# Altium schematic sheet ISO_SPI.SchDoc
size A
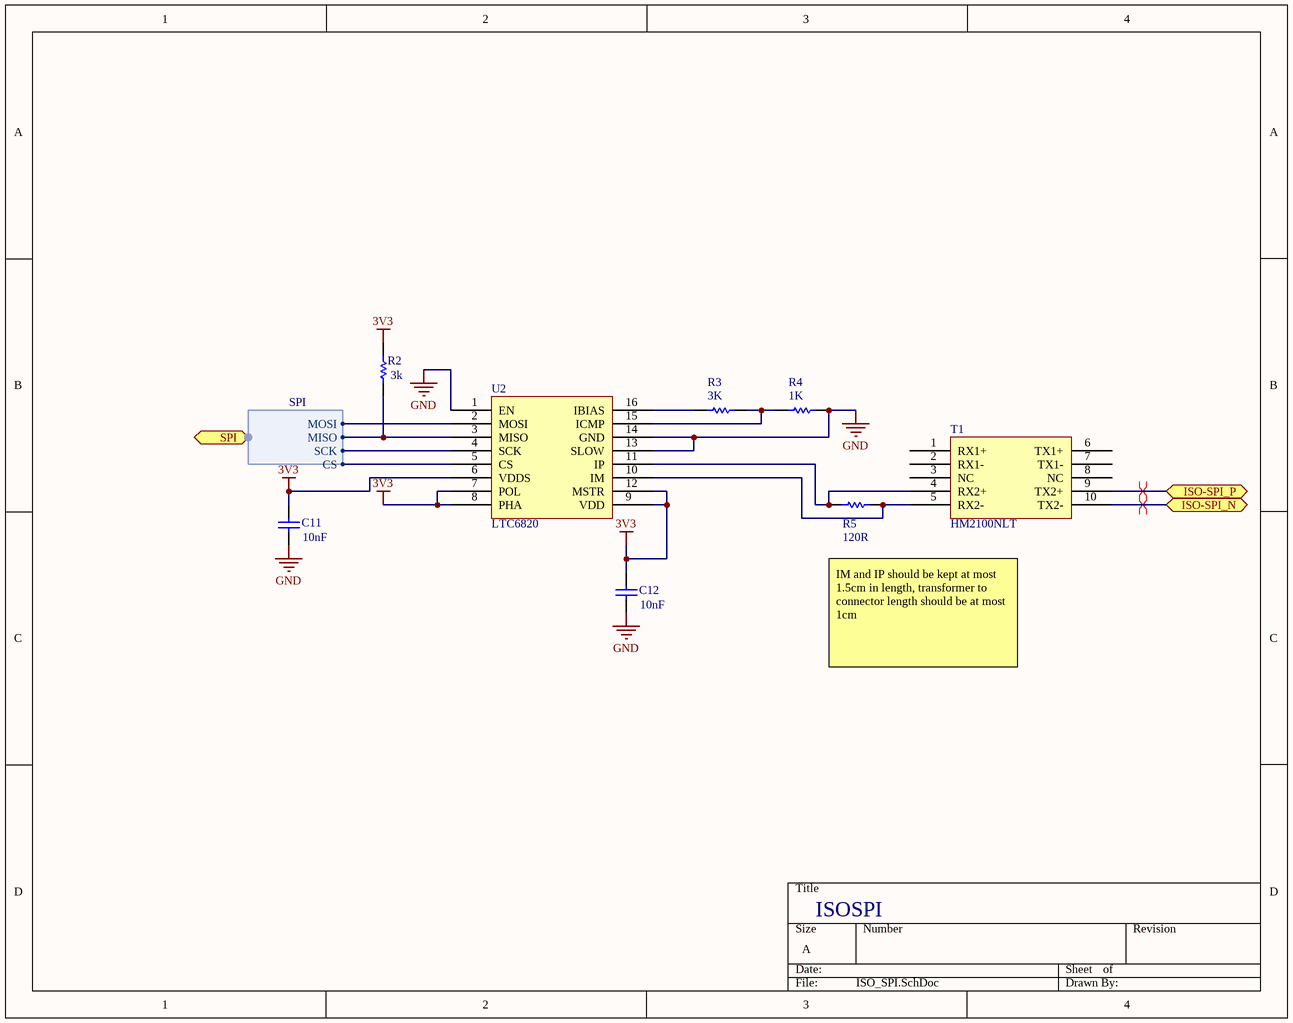
[diagram p0: ISO_SPI.SchDoc]

## Parts
C11  value 10nF  [C0805]  (hidden comment: 10V)
C12  value 10nF  [C0805]  (hidden comment: 10V)
R2  value 3k  [J1-0603]  (hidden comment: 1%)
R3  value 3K  [J1-0603]  (hidden comment: 1%)
R4  value 1K  [J1-0603]  (hidden comment: 1%)
R5  value 120R  [J1-0603]  (hidden comment: 1%)
T1  HM2100NLT  [HM2100NLT]
U2  LTC6820  [LTC6820]

## Ports
ISO-SPI_N (bidir), ISO-SPI_P (bidir), SPI (bidir, harness SPI)

## Harnesses
SPI: MOSI, MISO, SCK, CS

## Nets
3V3: C11.1 C12.1 R2.2 U2.6(VDDS) U2.7(POL) U2.8(PHA) U2.9(VDD) U2.12(MSTR)
GND: C11.2 C12.2 R4.2 U2.1(EN) U2.13(SLOW) U2.14(GND)
ISO-SPI_N: T1.10(TX2-) ; port ISO-SPI_N
ISO-SPI_P: T1.9(TX2+) ; port ISO-SPI_P
NetR2_1: R2.1 U2.3(MISO) ; port SPI.MISO
NetR3_1: R3.1 U2.16(IBIAS)
NetR3_2: R3.2 R4.1 U2.15(ICMP)
NetR5_1: R5.1 T1.4(RX2+) U2.11(IP)
NetR5_2: R5.2 T1.5(RX2-) U2.10(IM)
NetU2_2: U2.2(MOSI) ; port SPI.MOSI
NetU2_4: U2.4(SCK) ; port SPI.SCK
NetU2_5: U2.5(CS) ; port SPI.CS

Not connected (* = marked no-connect by the designer): T1 1(RX1+) 2(RX1-) 3(NC) 6(TX1+) 7(TX1-) 8(NC)

## Layout directives
differential pair: ISO-SPI_N, ISO-SPI_P

## Notes on the sheet
- IM and IP should be kept at most 1.5cm in length, transformer to connector length should be at most 1cm
- ISOSPI

## Library data of the parts
C11 C12 = Cap: C0805C103K8RAC7800. 10000pF ±10% 10V Ceramic Capacitor X7R 0805 (2012 Metric) /; Published: 8-Jun-2000; LatestRevisionDate: 17-Jul-2002; LatestRevisionNote: Re-released for DXP Platform.; PackageReference: RAD-0.3; Publisher: Altium Limited; PackageDescription: Radial Cap, Thru-Hole; 2 Leads; 0.3 in Pin Spacing
R2 R3 = Res1: RMCF0603FT3K00. 3 kOhms ±1% 0.1W, 1/10W Chip Resistor 0603 (1608 Metric) Automotive AEC-Q200 Thick Film /; Published: 8-Jun-2000; LatestRevisionDate: 17-Jul-2002; LatestRevisionNote: Re-released for DXP Platform.; PackageReference: AXIAL-0.3; Publisher: Altium Limited; PackageDescription: Axial Device, Thru-Hole; 2 Leads; 0.3 in Pin Spacing
R4 = Res1: RC0603FR-071KL .1 kOhms ±1% 0.1W, 1/10W Chip Resistor 0603 (1608 Metric) Moisture Resistant Thick Film /; Published: 8-Jun-2000; LatestRevisionDate: 17-Jul-2002; LatestRevisionNote: Re-released for DXP Platform.; PackageReference: AXIAL-0.3; Publisher: Altium Limited; PackageDescription: Axial Device, Thru-Hole; 2 Leads; 0.3 in Pin Spacing
R5 = Res1: RC0603FR-07120RL. 120 Ohms ±1% 0.1W, 1/10W Chip Resistor 0603 (1608 Metric) Moisture Resistant Thick Film /; Published: 8-Jun-2000; LatestRevisionDate: 17-Jul-2002; LatestRevisionNote: Re-released for DXP Platform.; PackageReference: AXIAL-0.3; Publisher: Altium Limited; PackageDescription: Axial Device, Thru-Hole; 2 Leads; 0.3 in Pin Spacing